# Altium schematic sheet H22R2x_Frontend 2.SchDoc
size Letter; CompanyName: Hexabitz; DocumentNumber: 3; SheetNumber: 3; SheetTotal: 3
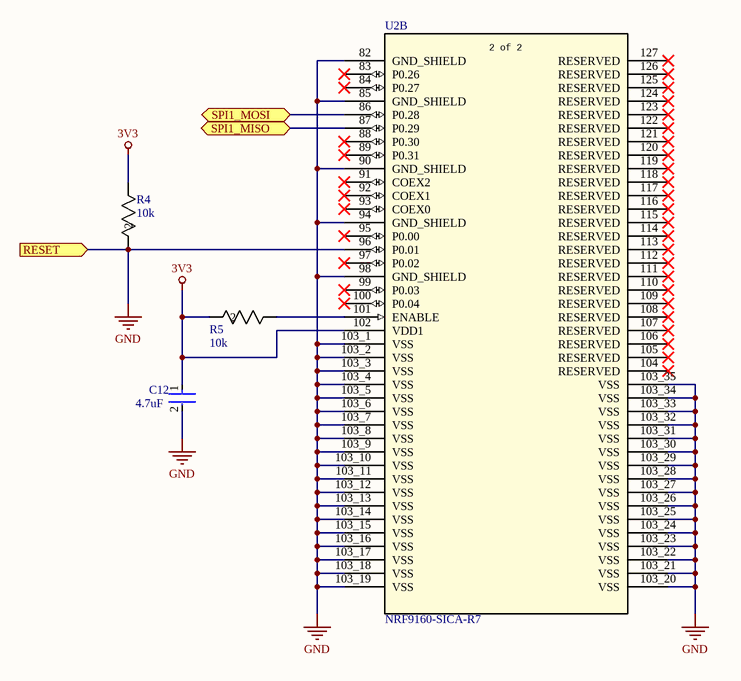
[diagram p0: H22R2x_Frontend 2.SchDoc]

## Parts
C12  4.7uF  [FP-0603-L_1_6_0_15-W_0_8-MFG]
R4  10k  [RC0201N_VIS]
R5  10k  [RC0201N_VIS]
U2  NRF9160-SICA-R7  [LGA127_16p00X10p50_nRF9160_NOR]  (part B of 2)

## Ports
RESET (in), SPI1_MISO (bidir), SPI1_MOSI (bidir)

## Nets
3V3: C12.1 R4.1 R5.2 U2.102(VDD1)
GND: C12.2 R4.2 U2.82(GND_SHIELD) U2.85(GND_SHIELD) U2.90(GND_SHIELD) U2.94(GND_SHIELD) U2.96(P0.01) U2.98(GND_SHIELD) U2.103_1(VSS) U2.103_2(VSS) U2.103_3(VSS) U2.103_4(VSS) U2.103_5(VSS) U2.103_6(VSS) U2.103_7(VSS) U2.103_8(VSS) U2.103_9(VSS) U2.103_10(VSS) U2.103_11(VSS) U2.103_12(VSS) U2.103_13(VSS) U2.103_14(VSS) U2.103_15(VSS) U2.103_16(VSS) U2.103_17(VSS) U2.103_18(VSS) U2.103_19(VSS) U2.103_20(VSS) U2.103_21(VSS) U2.103_22(VSS) U2.103_23(VSS) U2.103_24(VSS) U2.103_25(VSS) U2.103_26(VSS) U2.103_27(VSS) U2.103_28(VSS) U2.103_29(VSS) U2.103_30(VSS) U2.103_31(VSS) U2.103_32(VSS) U2.103_33(VSS) U2.103_34(VSS) U2.103_35(VSS) ; port RESET
SPI1_MISO: U2.87(P0.29) ; port SPI1_MISO
SPI1_MOSI: U2.86(P0.28) ; port SPI1_MOSI
NetR5_1: R5.1 U2.101(ENABLE)

Not connected (* = marked no-connect by the designer): U2 83(P0.26)* 84(P0.27)* 88(P0.30)* 89(P0.31)* 91(COEX2)* 92(COEX1)* 93(COEX0)* 95(P0.00)* 97(P0.02)* 99(P0.03)* 100(P0.04)* 104(RESERVED)* 105(RESERVED)* 106(RESERVED)* 107(RESERVED)* 108(RESERVED)* 109(RESERVED)* 110(RESERVED)* 111(RESERVED)* 112(RESERVED)* 113(RESERVED)* 114(RESERVED)* 115(RESERVED)* 116(RESERVED)* 117(RESERVED)* 118(RESERVED)* 119(RESERVED)* 120(RESERVED)* 121(RESERVED)* 122(RESERVED)* 123(RESERVED)* 124(RESERVED)* 125(RESERVED)* 126(RESERVED)* 127(RESERVED)*

## Notes on the sheet
- Module:
- Title:
- Description:
- Size:
- Revision:
- Letter
- www.hexabitz.com
- Date:
- Time:
- Sheet
- of
- (in symbol CMP-006-000000-1, part B) 2 of 2

## Library data of the parts
C12 = CMP-14477-003024-3: Ceramic Capacitor General Use 4.7uF ±10% 10V X6S 0603; NexarPartId: 75346097; Capacitance: 4.7µF; Material: Ceramic; Voltage Rating (DC): 10V; Case/Package: 0603; Height: 950µm; Max Operating Temperature: 105°C; RoHS: Non-Compliant; Tolerance: 10%; Min Operating Temperature: -55°C; Voltage Rating: 10V
R4 R5 = CMP-009-00177-1: CRCW0201 200 10K 1% ET7 e3; Manufacturer_Name: Vishay; Source: CRCW020110K0FNED.SchLib; Datasheet: https://www.vishay.com/doc?20052; Copyright: Copyright (C) 2025 Ultra Librarian. All rights reserved.; Design Item ID: CRCW020110K0FNED; Manufacturer_Part_Number: CRCW020110K0FNED
U2 = CMP-006-000000-1: Description; Manufacturer_Name: Nordic Semiconductor; Type: RF; Manufacturer_Part_Number: NRF9160-SICA-R7; RefDes: RefDes; Design Item ID: NRF9160-SICA-R7; Source: NRF9160-SICA-R7.SchLib; Copyright: Copyright (C) 2025 Ultra Librarian. All rights reserved.